# Altium schematic sheet LIB.SchDoc
size A4; SheetNumber: 1; SheetTotal: 1
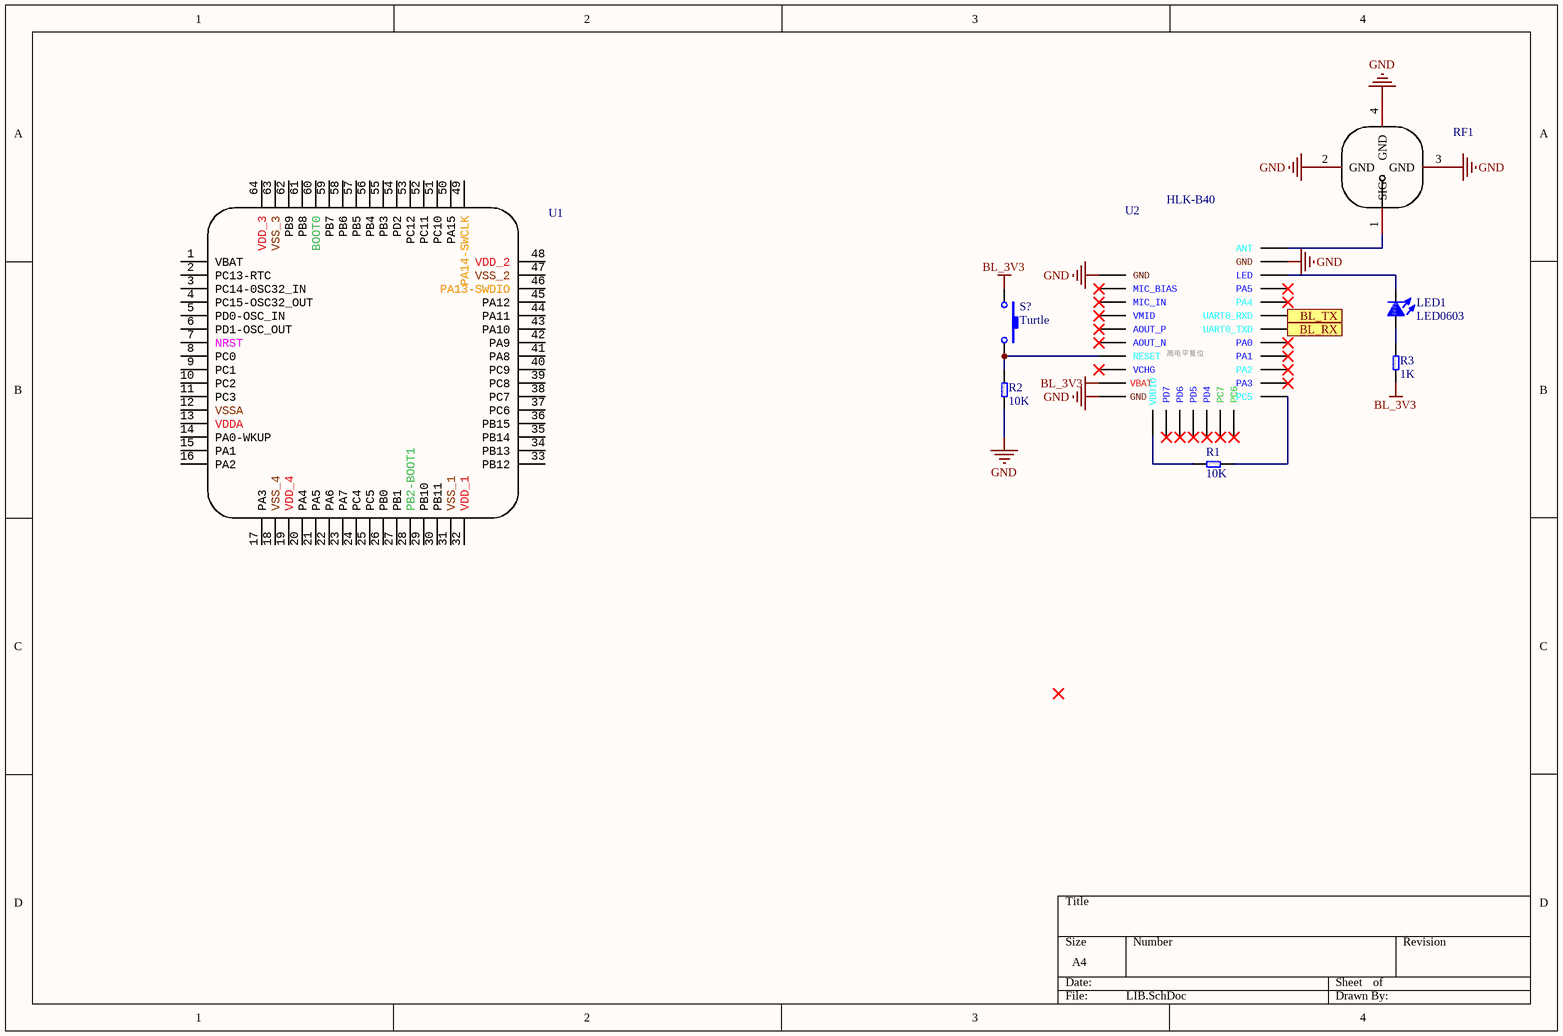
[diagram p0: LIB.SchDoc]

## Parts
LED1  LED0603  [D0603]
R1  10K  [R0402]
R2  10K  [R0402]
R3  1K  [R0402]
RF1  KH-IPEX-K501-29  [ANT-SMD_KH-IPEX-K501-29]  (value not drawn)
S?  Turtle  [SW-Turtle_TS-015A]
U1  STM32F103R  [LQFP-64_L10.0-W10.0-P0.50-LS12.0-BL]  (value not drawn)
U2  HLK-B40  [HLK-B40]

## Ports
BL_RX, BL_TX

## Nets
BL_3V3: R3.2 S?.1 U2.9(VBAT)
GND: R2.2 RF1.2(GND) RF1.3(GND) RF1.4(GND) U2.1(GND) U2.10(GND) U2.28(GND)
BL_RX: U2.23(UART0_TXD) ; port BL_RX
BL_TX: U2.24(UART0_RXD) ; port BL_TX
NetLED1_A: LED1.A R3.1
NetLED1_K: LED1.K U2.27(LED)
NetR1_1: R1.1 U2.18(PC5)
NetR1_2: R1.2 U2.11(VDDIO)
NetR2_1: R2.1 S?.2 U2.7(RESET)
NetRF1_1: RF1.1(SIG) U2.29(ANT)

Not connected (* = marked no-connect by the designer): U1 1(VBAT) 2(PC13-RTC) 3(PC14-0SC32_IN) 4(PC15-OSC32_OUT) 5(PD0-OSC_IN) 6(PD1-OSC_OUT) 7(NRST) 8(PC0) 9(PC1) 10(PC2) 11(PC3) 12(VSSA) 13(VDDA) 14(PA0-WKUP) 15(PA1) 16(PA2) 17(PA3) 18(VSS_4) 19(VDD_4) 20(PA4) 21(PA5) 22(PA6) 23(PA7) 24(PC4) 25(PC5) 26(PB0) 27(PB1) 28(PB2-BOOT1) 29(PB10) 30(PB11) 31(VSS_1) 32(VDD_1) 33(PB12) 34(PB13) 35(PB14) 36(PB15) 37(PC6) 38(PC7) 39(PC8) 40(PC9) 41(PA8) 42(PA9) 43(PA10) 44(PA11) 45(PA12) 46(PA13-SWDIO) 47(VSS_2) 48(VDD_2) 49(PA14-SWCLK) 50(PA15) 51(PC10) 52(PC11) 53(PC12) 54(PD2) 55(PB3) 56(PB4) 57(PB5) 58(PB6) 59(PB7) 60(BOOT0) 61(PB8) 62(PB9) 63(VSS_3) 64(VDD_3); U2 2(MIC_BIAS)* 3(MIC_IN)* 4(VMID)* 5(AOUT_P)* 6(AOUT_N)* 8(VCHG)* 12(PD7)* 13(PD6)* 14(PD5)* 15(PD4)* 16(PC7)* 17(PC6)* 19(PA3)* 20(PA2)* 21(PA1)* 22(PA0)* 25(PA4)* 26(PA5)*

## Notes on the sheet
- (in symbol HLK-B40) 高电平复位
- (in symbol LED0603) 0603
- (in symbol R0402) 0402

## Library data of the parts
LED1 = LED0603: 发光颜色
R1-R3 = R0402: 阻值,精度,电阻类型
RF1 = KH-IPEX-K501-29: 连接器类型:板端;射频系列:IPEX;接口类型:内针;端口数量:1;阻抗:50Ω;频率-最大值:3GHz;样式:-;接口直径:2mm;接口长度/高度:1.25mm;工作温度范围:-40℃~+90℃;; Manufacturer: kinghelm(金航标); Add into BOM: yes; Connector Type: 板端; RF Series: IPEX; Interface Type: 内针; Number of Ports: 1; Impedance: 50Ω; Frequency-Max: 3GHz; Interface Diameter: 2mm; Interface Length/Height: 1.25mm; Name: KH-IPEX-K501-29; Symbol: KH-IPEX-K501-29; Device: KH-IPEX-K501-29; LCSC Part Name: IPEX内针1代; Supplier Part: C411563; Manufacturer Part: KH-IPEX-K501-29; Supplier Footprint: SMD; JLCPCB Part Class: ExtendedPart; Datasheet: https://atta.szlcsc.com/upload/public/pdf/source/20210317/C411563_B117163D510F1EF8C12FF082F555A034.pdf; Supplier: LCSC; Convert to PCB: yes; Style: -; Operating Temperature Range: -40℃~+90℃
S? = SW-Turtle: 微触开关-龟型
U1 = STM32F103R: Add into BOM: yes; Name: STM32F103R; Symbol: STM32F103R; Device: STM32F103R; Convert to PCB: yes
U2 = HLK-B40: HLK-B40蓝牙模块